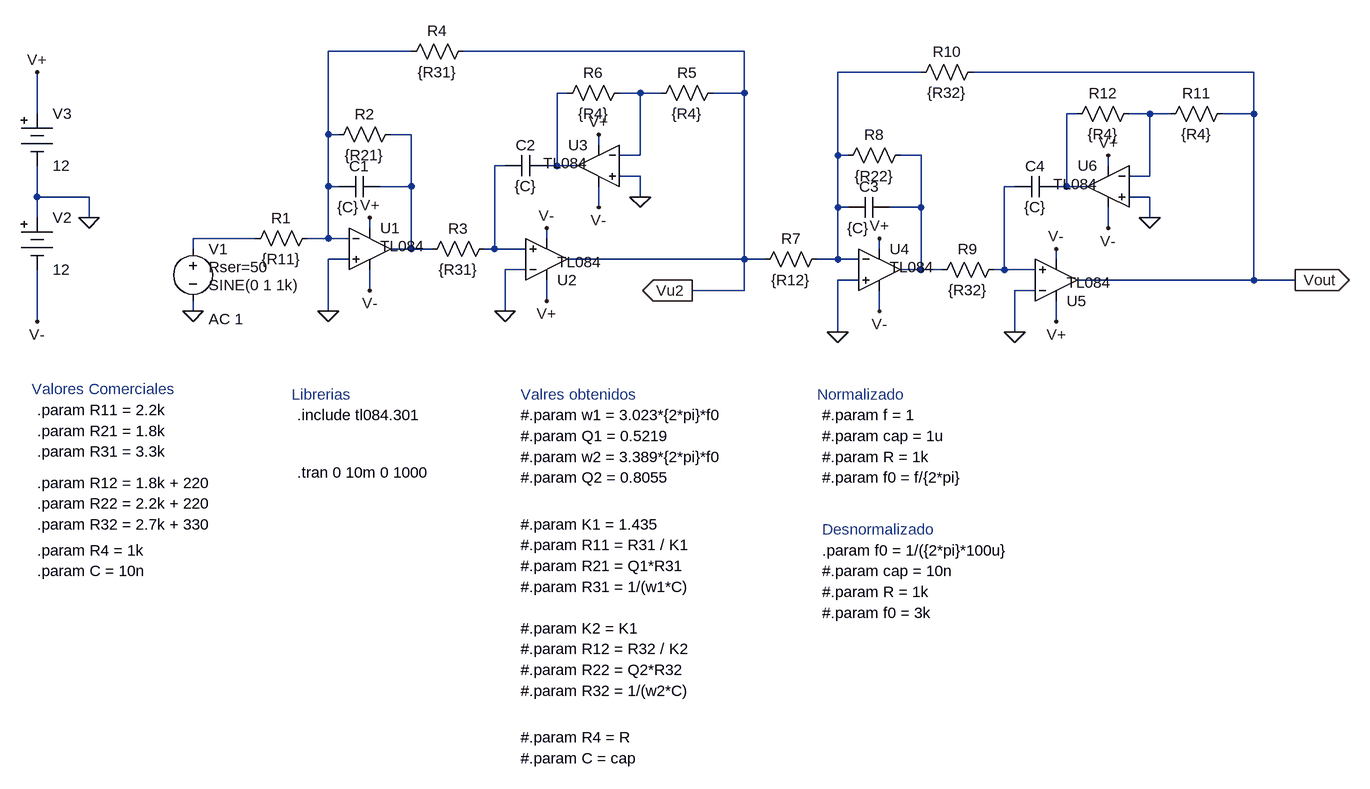
[diagram p0: schematic laboratorio1.asc]
laboratorio1.asc, the LTspice schematic file:
Version 4
SHEET 1 1652 1024
WIRE 176 -80 48 -80
WIRE 688 -80 256 -80
WIRE 960 -48 832 -48
WIRE 1472 -48 1040 -48
WIRE 416 -16 400 -16
WIRE 528 -16 496 -16
WIRE 560 -16 528 -16
WIRE 688 -16 688 -80
WIRE 688 -16 640 -16
WIRE -400 16 -400 -48
WIRE 1200 16 1184 16
WIRE 1312 16 1280 16
WIRE 1344 16 1312 16
WIRE 1472 16 1472 -48
WIRE 1472 16 1424 16
WIRE 48 48 48 -80
WIRE 64 48 48 48
WIRE 176 48 144 48
WIRE 464 64 464 48
WIRE 528 80 528 -16
WIRE 528 80 496 80
WIRE 832 80 832 -48
WIRE 848 80 832 80
WIRE 960 80 928 80
WIRE 320 96 304 96
WIRE 400 96 400 -16
WIRE 400 96 384 96
WIRE 432 96 400 96
WIRE 1248 96 1248 80
WIRE 528 112 496 112
WIRE 1312 112 1312 16
WIRE 1312 112 1280 112
WIRE 48 128 48 48
WIRE 64 128 48 128
WIRE 176 128 176 48
WIRE 176 128 128 128
WIRE 1104 128 1088 128
WIRE 1184 128 1184 16
WIRE 1184 128 1168 128
WIRE 1216 128 1184 128
WIRE -400 144 -400 96
WIRE -320 144 -400 144
WIRE 528 144 528 112
WIRE 1312 144 1280 144
WIRE 464 160 464 128
WIRE 832 160 832 80
WIRE 848 160 832 160
WIRE 960 160 960 80
WIRE 960 160 912 160
WIRE -400 176 -400 144
WIRE -320 176 -320 144
WIRE 1312 176 1312 144
WIRE 112 192 112 176
WIRE 1248 192 1248 160
WIRE -64 208 -160 208
WIRE 48 208 48 128
WIRE 48 208 16 208
WIRE 80 208 48 208
WIRE 384 208 384 192
WIRE -160 224 -160 208
WIRE 176 224 176 128
WIRE 176 224 144 224
WIRE 208 224 176 224
WIRE 304 224 304 96
WIRE 304 224 288 224
WIRE 352 224 304 224
WIRE 896 224 896 208
WIRE 80 240 48 240
WIRE 688 240 688 -16
WIRE 688 240 416 240
WIRE 720 240 688 240
WIRE 832 240 832 160
WIRE 832 240 800 240
WIRE 864 240 832 240
WIRE 1168 240 1168 224
WIRE 352 256 320 256
WIRE 960 256 960 160
WIRE 960 256 928 256
WIRE 992 256 960 256
WIRE 1088 256 1088 128
WIRE 1088 256 1072 256
WIRE 1136 256 1088 256
WIRE 864 272 832 272
WIRE 1472 272 1472 16
WIRE 1472 272 1200 272
WIRE 1536 272 1472 272
WIRE 112 288 112 256
WIRE 688 288 688 240
WIRE 688 288 608 288
WIRE 1136 288 1104 288
WIRE 384 304 384 272
WIRE -160 320 -160 304
WIRE 48 320 48 240
WIRE 320 320 320 256
WIRE 896 320 896 288
WIRE -400 336 -400 256
WIRE 1168 336 1168 304
WIRE 832 352 832 272
WIRE 1104 352 1104 288
FLAG 48 320 0
FLAG 320 320 0
FLAG -160 320 0
FLAG 528 144 0
FLAG -320 176 0
FLAG -400 336 V-
FLAG 384 192 V-
FLAG 112 288 V-
FLAG 464 160 V-
FLAG -400 -48 V+
FLAG 112 176 V+
FLAG 384 304 V+
FLAG 464 48 V+
FLAG 832 352 0
FLAG 1104 352 0
FLAG 1312 176 0
FLAG 1168 224 V-
FLAG 896 320 V-
FLAG 1248 192 V-
FLAG 896 208 V+
FLAG 1168 336 V+
FLAG 1248 80 V+
FLAG 1536 272 Vout
IOPIN 1536 272 Out
FLAG 608 288 Vu2
IOPIN 608 288 Out
SYMBOL OpAmps\\opamp2 112 160 R0
WINDOW 3 16 60 Left 2
SYMATTR Value TL084
SYMATTR InstName U1
SYMBOL OpAmps\\opamp2 384 304 M180
WINDOW 3 16 60 Left 2
SYMATTR Value TL084
SYMATTR InstName U2
SYMBOL OpAmps\\opamp2 464 32 M0
WINDOW 3 16 60 Left 2
SYMATTR Value TL084
SYMATTR InstName U3
SYMBOL res 32 192 R90
WINDOW 0 0 56 VBottom 2
WINDOW 3 32 56 VTop 2
SYMATTR InstName R1
SYMATTR Value {R11}
SYMBOL res 160 32 R90
WINDOW 0 0 56 VBottom 2
WINDOW 3 32 56 VTop 2
SYMATTR InstName R2
SYMATTR Value {R21}
SYMBOL res 304 208 R90
WINDOW 0 0 56 VBottom 2
WINDOW 3 32 56 VTop 2
SYMATTR InstName R3
SYMATTR Value {R31}
SYMBOL res 272 -96 R90
WINDOW 0 0 56 VBottom 2
WINDOW 3 32 56 VTop 2
SYMATTR InstName R4
SYMATTR Value {R31}
SYMBOL res 656 -32 R90
WINDOW 0 0 56 VBottom 2
WINDOW 3 32 56 VTop 2
SYMATTR InstName R5
SYMATTR Value {R4}
SYMBOL res 512 -32 R90
WINDOW 0 0 56 VBottom 2
WINDOW 3 32 56 VTop 2
SYMATTR InstName R6
SYMATTR Value {R4}
SYMBOL cap 128 112 R90
WINDOW 0 0 32 VBottom 2
WINDOW 3 32 49 VTop 2
SYMATTR InstName C1
SYMATTR Value {C}
SYMBOL cap 384 80 R90
WINDOW 0 0 32 VBottom 2
WINDOW 3 32 32 VTop 2
SYMATTR InstName C2
SYMATTR Value {C}
SYMBOL voltage -160 208 R0
WINDOW 123 24 124 Left 2
WINDOW 39 24 44 Left 2
WINDOW 3 24 72 Left 2
SYMATTR Value2 AC 1
SYMATTR SpiceLine Rser=50
SYMATTR InstName V1
SYMATTR Value SINE(0 1 1k)
SYMBOL Misc\\battery -400 160 R0
WINDOW 123 0 0 Left 0
WINDOW 39 0 0 Left 0
SYMATTR InstName V2
SYMATTR Value 12
SYMBOL Misc\\battery -400 0 R0
WINDOW 123 0 0 Left 0
WINDOW 39 0 0 Left 0
SYMATTR InstName V3
SYMATTR Value 12
SYMBOL OpAmps\\opamp2 896 192 R0
WINDOW 3 16 60 Left 2
SYMATTR Value TL084
SYMATTR InstName U4
SYMBOL OpAmps\\opamp2 1168 336 M180
WINDOW 3 16 60 Left 2
SYMATTR Value TL084
SYMATTR InstName U5
SYMBOL OpAmps\\opamp2 1248 64 M0
WINDOW 3 16 60 Left 2
SYMATTR Value TL084
SYMATTR InstName U6
SYMBOL res 816 224 R90
WINDOW 0 0 56 VBottom 2
WINDOW 3 32 56 VTop 2
SYMATTR InstName R7
SYMATTR Value {R12}
SYMBOL res 944 64 R90
WINDOW 0 0 56 VBottom 2
WINDOW 3 32 56 VTop 2
SYMATTR InstName R8
SYMATTR Value {R22}
SYMBOL res 1088 240 R90
WINDOW 0 0 56 VBottom 2
WINDOW 3 32 56 VTop 2
SYMATTR InstName R9
SYMATTR Value {R32}
SYMBOL res 1056 -64 R90
WINDOW 0 0 56 VBottom 2
WINDOW 3 32 56 VTop 2
SYMATTR InstName R10
SYMATTR Value {R32}
SYMBOL res 1440 0 R90
WINDOW 0 0 56 VBottom 2
WINDOW 3 32 56 VTop 2
SYMATTR InstName R11
SYMATTR Value {R4}
SYMBOL res 1296 0 R90
WINDOW 0 0 56 VBottom 2
WINDOW 3 32 56 VTop 2
SYMATTR InstName R12
SYMATTR Value {R4}
SYMBOL cap 912 144 R90
WINDOW 0 0 32 VBottom 2
WINDOW 3 32 49 VTop 2
SYMATTR InstName C3
SYMATTR Value {C}
SYMBOL cap 1168 112 R90
WINDOW 0 0 32 VBottom 2
WINDOW 3 32 32 VTop 2
SYMATTR InstName C4
SYMATTR Value {C}
TEXT -408 440 Left 2 ;Valores Comerciales
TEXT -400 472 Left 2 !.param R11 = 2.2k
TEXT -400 536 Left 2 !.param R31 = 3.3k
TEXT -400 504 Left 2 !.param R21 = 1.8k
TEXT -400 720 Left 2 !.param C = 10n
TEXT -8 448 Left 2 ;Librerias
TEXT 0 480 Left 2 !.include tl084.301
TEXT 0 568 Left 2 !.tran 0 10m 0 1000
TEXT -400 688 Left 2 !.param R4 = 1k
TEXT 800 448 Left 2 ;Normalizado
TEXT 344 480 Left 2 !#.param w1 = 3.023*{2*pi}*f0
TEXT 344 512 Left 2 !#.param Q1 = 0.5219
TEXT 344 744 Left 2 !#.param R31 = 1/(w1*C)
TEXT 344 712 Left 2 !#.param R21 = Q1*R31
TEXT 344 1008 Left 2 !#.param C = cap
TEXT 808 544 Left 2 !#.param R = 1k
TEXT 344 544 Left 2 !#.param w2 = 3.389*{2*pi}*f0
TEXT 344 680 Left 2 !#.param R11 = R31 / K1
TEXT 808 576 Left 2 !#.param f0 = f/{2*pi}
TEXT 808 480 Left 2 !#.param f = 1
TEXT 344 448 Left 2 ;Valres obtenidos
TEXT 344 976 Left 2 !#.param R4 = R
TEXT 808 512 Left 2 !#.param cap = 1u
TEXT 808 656 Left 2 ;Desnormalizado
TEXT 808 752 Left 2 !#.param R = 1k
TEXT 808 720 Left 2 !#.param cap = 10n
TEXT 808 688 Left 2 !.param f0 = 1/({2*pi}*100u}
TEXT 808 784 Left 2 !#.param f0 = 3k
TEXT 344 576 Left 2 !#.param Q2 = 0.8055
TEXT 344 648 Left 2 !#.param K1 = 1.435
TEXT 344 904 Left 2 !#.param R32 = 1/(w2*C)
TEXT 344 872 Left 2 !#.param R22 = Q2*R32
TEXT 344 840 Left 2 !#.param R12 = R32 / K2
TEXT 344 808 Left 2 !#.param K2 = K1
TEXT -400 584 Left 2 !.param R12 = 1.8k + 220
TEXT -400 616 Left 2 !.param R22 = 2.2k + 220
TEXT -400 648 Left 2 !.param R32 = 2.7k + 330

The netlist it stands for:
* laboratorio1.asc
XU1 0 N001 V+ V- N007 TL084  ; pins In+ In- V+ V- OUT
XU2 N009 0 V+ V- Vu2 TL084  ; pins In+ In- V+ V- OUT
XU3 0 N004 V+ V- N003 TL084  ; pins In+ In- V+ V- OUT
R1 N001 N011 {R11}
R2 N007 N001 {R21}
R3 N009 N007 {R31}
R4 Vu2 N001 {R31}
R5 Vu2 N004 {R4}
R6 N004 N003 {R4}
C1 N007 N001 {C}
C2 N003 N009 {C}
V1 N011 0 SINE(0 1 1k) AC 1 Rser=50
V2 0 V- 12
V3 V+ 0 12
XU4 0 N002 V+ V- N008 TL084  ; pins In+ In- V+ V- OUT
XU5 N010 0 V+ V- Vout TL084  ; pins In+ In- V+ V- OUT
XU6 0 N006 V+ V- N005 TL084  ; pins In+ In- V+ V- OUT
R7 N002 Vu2 {R12}
R8 N008 N002 {R22}
R9 N010 N008 {R32}
R10 Vout N002 {R32}
R11 Vout N006 {R4}
R12 N006 N005 {R4}
C3 N008 N002 {C}
C4 N005 N010 {C}
* Valores Comerciales
.param R11 = 2.2k
.param R31 = 3.3k
.param R21 = 1.8k
.param C = 10n
* Librerias
.include tl084.301
.tran 0 10m 0 1000
.param R4 = 1k
* Normalizado
#.param w1 = 3.023*{2*pi}*f0
#.param Q1 = 0.5219
#.param R31 = 1/(w1*C)
#.param R21 = Q1*R31
#.param C = cap
#.param R = 1k
#.param w2 = 3.389*{2*pi}*f0
#.param R11 = R31 / K1
#.param f0 = f/{2*pi}
#.param f = 1
* Valres obtenidos
#.param R4 = R
#.param cap = 1u
* Desnormalizado
#.param R = 1k
#.param cap = 10n
.param f0 = 1/({2*pi}*100u}
#.param f0 = 3k
#.param Q2 = 0.8055
#.param K1 = 1.435
#.param R32 = 1/(w2*C)
#.param R22 = Q2*R32
#.param R12 = R32 / K2
#.param K2 = K1
.param R12 = 1.8k + 220
.param R22 = 2.2k + 220
.param R32 = 2.7k + 330
.backanno
.end